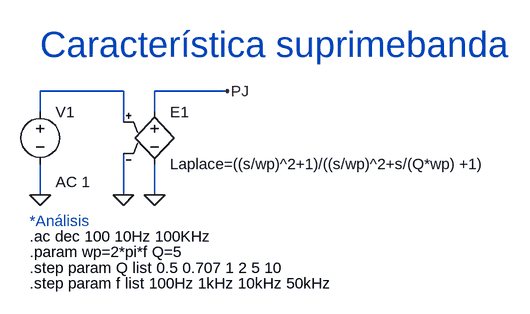
[diagram p0: schematic característicafiltrosuprimebanda.asc]
característicafiltrosuprimebanda.asc, the LTspice schematic file:
Version 4
SHEET 1 880 680
WIRE 16 112 -112 112
WIRE 176 112 64 112
WIRE -112 144 -112 112
WIRE 64 144 64 112
WIRE 16 160 16 112
WIRE -112 272 -112 224
WIRE 16 272 16 208
WIRE 64 272 64 224
FLAG 176 112 PJ
FLAG 64 272 0
FLAG 16 272 0
FLAG -112 272 0
SYMBOL voltage -112 128 R0
WINDOW 123 24 124 Left 2
WINDOW 39 0 0 Left 0
SYMATTR InstName V1
SYMATTR Value ""
SYMATTR Value2 AC 1
SYMBOL e 64 128 R0
SYMATTR InstName E1
SYMATTR Value Laplace=((s/wp)^2+1)/((s/wp)^2+s/(Q*wp) +1)
TEXT -128 312 Left 2 ;*Análisis
TEXT -128 336 Left 2 !.ac dec 100 10Hz 100KHz
TEXT -128 360 Left 2 !.param wp=2*pi*f Q=5
TEXT -128 384 Left 2 !.step param Q list 0.5 0.707 1 2 5 10
TEXT -128 408 Left 2 !.step param f list 100Hz 1kHz 10kHz 50kHz
TEXT -112 40 Left 5 ;Característica suprimebanda

The netlist it stands for:
* característicafiltrosuprimebanda.asc
V1 N001 0 AC 1
E1 PJ 0 N001 0 Laplace=((s/wp)^2+1)/((s/wp)^2+s/(Q*wp) +1)
* *Análisis
.ac dec 100 10Hz 100KHz
.param wp=2*pi*f Q=5
.step param Q list 0.5 0.707 1 2 5 10
.step param f list 100Hz 1kHz 10kHz 50kHz
* Característica suprimebanda
.backanno
.end